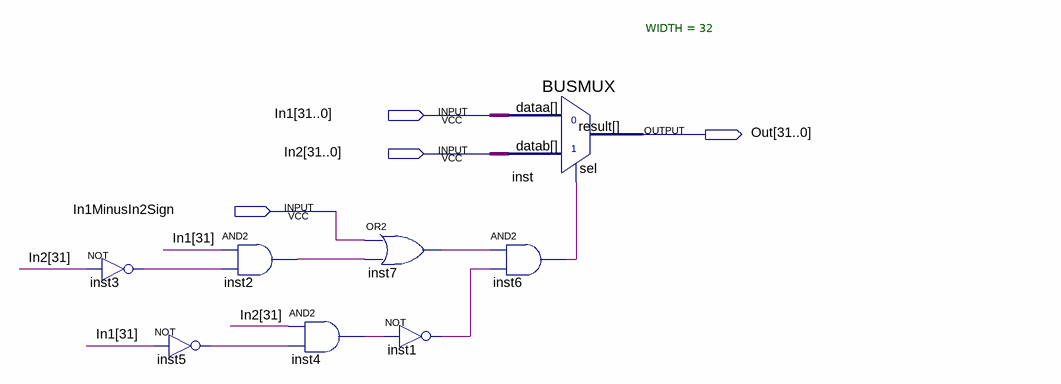
[diagram p0: schematic sheet]
// Quartus schematic Max.bdf as structural Verilog: 8 symbols, 4 pins
module Max (
  input  [31:0] In1,
  input  [31:0] In2,
  input  In1MinusIn2Sign,
  output [31:0] Out
);

  wire inst1_out, inst2_out, inst3_out, inst4_out, inst5_out, inst6_out, inst7_out;

  not inst3 (inst3_out, In2[31]);
  not inst5 (inst5_out, In1[31]);
  and inst2 (inst2_out, In1[31], inst3_out);
  and inst4 (inst4_out, In2[31], inst5_out);
  or inst7 (inst7_out, In1MinusIn2Sign, inst2_out);
  not inst1 (inst1_out, inst4_out);
  BUSMUX #(.WIDTH(32)) inst (.datab(In2), .sel(inst6_out), .dataa(In1), .result(Out));
  and inst6 (inst6_out, inst7_out, inst1_out);
endmodule
